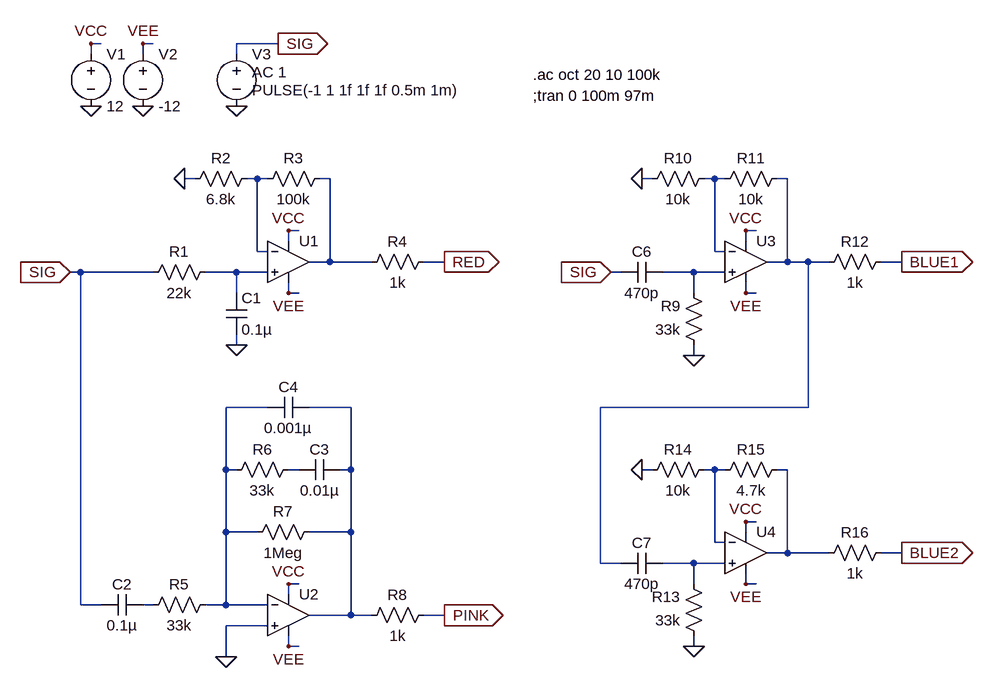
[diagram p0: schematic NOS02_Filter.asc]
NOS02_Filter.asc, the LTspice schematic file:
Version 4
SHEET 1 1352 1156
WIRE -16 -432 -32 -432
WIRE 64 -432 48 -432
WIRE 256 -432 192 -432
WIRE -32 -416 -32 -432
WIRE 48 -416 48 -432
WIRE 192 -416 192 -432
WIRE 128 -224 112 -224
WIRE 224 -224 208 -224
WIRE 240 -224 224 -224
WIRE 336 -224 320 -224
WIRE 832 -224 816 -224
WIRE 928 -224 912 -224
WIRE 944 -224 928 -224
WIRE 1040 -224 1024 -224
WIRE 288 -144 272 -144
WIRE 992 -144 976 -144
WIRE 272 -128 272 -144
WIRE 976 -128 976 -144
WIRE 224 -112 224 -224
WIRE 240 -112 224 -112
WIRE 928 -112 928 -224
WIRE 944 -112 928 -112
WIRE 336 -96 336 -224
WIRE 336 -96 304 -96
WIRE 400 -96 336 -96
WIRE 512 -96 480 -96
WIRE 1040 -96 1040 -224
WIRE 1040 -96 1008 -96
WIRE 1072 -96 1040 -96
WIRE 1104 -96 1072 -96
WIRE 1216 -96 1184 -96
WIRE -48 -80 -64 -80
WIRE 64 -80 -48 -80
WIRE 192 -80 144 -80
WIRE 240 -80 192 -80
WIRE 784 -80 768 -80
WIRE 896 -80 848 -80
WIRE 944 -80 896 -80
WIRE 192 -48 192 -80
WIRE 272 -48 272 -64
WIRE 288 -48 272 -48
WIRE 896 -48 896 -80
WIRE 976 -48 976 -64
WIRE 992 -48 976 -48
WIRE 192 32 192 16
WIRE 896 48 896 32
WIRE 240 128 176 128
WIRE 368 128 304 128
WIRE 1072 128 1072 -96
WIRE 1072 128 752 128
WIRE 176 224 176 128
WIRE 192 224 176 224
WIRE 288 224 272 224
WIRE 368 224 368 128
WIRE 368 224 352 224
WIRE 832 224 816 224
WIRE 928 224 912 224
WIRE 944 224 928 224
WIRE 1040 224 1024 224
WIRE 992 304 976 304
WIRE 176 320 176 224
WIRE 224 320 176 320
WIRE 368 320 368 224
WIRE 368 320 304 320
WIRE 976 320 976 304
WIRE 928 336 928 224
WIRE 944 336 928 336
WIRE 1040 352 1040 224
WIRE 1040 352 1008 352
WIRE 1104 352 1040 352
WIRE 1216 352 1184 352
WIRE 752 368 752 128
WIRE 784 368 752 368
WIRE 896 368 848 368
WIRE 944 368 896 368
WIRE 288 400 272 400
WIRE 896 400 896 368
WIRE 976 400 976 384
WIRE 992 400 976 400
WIRE 272 416 272 400
WIRE -48 432 -48 -80
WIRE -16 432 -48 432
WIRE 64 432 48 432
WIRE 176 432 176 320
WIRE 176 432 144 432
WIRE 240 432 176 432
WIRE 368 448 368 320
WIRE 368 448 304 448
WIRE 400 448 368 448
WIRE 512 448 480 448
WIRE 240 464 176 464
WIRE 272 496 272 480
WIRE 288 496 272 496
WIRE 896 496 896 480
WIRE 176 512 176 464
FLAG 272 -144 VCC
FLAG 272 -48 VEE
FLAG 112 -224 0
FLAG 192 32 0
FLAG 272 400 VCC
FLAG 272 496 VEE
FLAG 176 512 0
FLAG -64 -80 SIG
IOPIN -64 -80 In
FLAG 512 -96 RED
IOPIN 512 -96 Out
FLAG 512 448 PINK
IOPIN 512 448 Out
FLAG -32 -336 0
FLAG 48 -336 0
FLAG -32 -432 VCC
FLAG 48 -432 VEE
FLAG 256 -432 SIG
IOPIN 256 -432 Out
FLAG 192 -336 0
FLAG 976 -144 VCC
FLAG 976 -48 VEE
FLAG 816 -224 0
FLAG 896 48 0
FLAG 1216 -96 BLUE1
IOPIN 1216 -96 Out
FLAG 768 -80 SIG
IOPIN 768 -80 In
FLAG 976 304 VCC
FLAG 976 400 VEE
FLAG 816 224 0
FLAG 896 496 0
FLAG 1216 352 BLUE2
IOPIN 1216 352 Out
SYMBOL Opamps\\UniversalOpamp2 272 -96 R0
SYMATTR InstName U1
SYMBOL res 160 -96 R90
WINDOW 0 0 56 VBottom 2
WINDOW 3 32 56 VTop 2
SYMATTR InstName R1
SYMATTR Value 22k
SYMBOL cap 176 -48 R0
SYMATTR InstName C1
SYMATTR Value 0.1µ
SYMBOL res 224 -240 R90
WINDOW 0 0 56 VBottom 2
WINDOW 3 32 56 VTop 2
SYMATTR InstName R2
SYMATTR Value 6.8k
SYMBOL res 336 -240 R90
WINDOW 0 0 56 VBottom 2
WINDOW 3 32 56 VTop 2
SYMATTR InstName R3
SYMATTR Value 100k
SYMBOL res 496 -112 R90
WINDOW 0 0 56 VBottom 2
WINDOW 3 32 56 VTop 2
SYMATTR InstName R4
SYMATTR Value 1k
SYMBOL Opamps\\UniversalOpamp2 272 448 R0
SYMATTR InstName U2
SYMBOL res 160 416 R90
WINDOW 0 0 56 VBottom 2
WINDOW 3 32 56 VTop 2
SYMATTR InstName R5
SYMATTR Value 33k
SYMBOL cap 48 416 R90
WINDOW 0 0 32 VBottom 2
WINDOW 3 32 32 VTop 2
SYMATTR InstName C2
SYMATTR Value 0.1µ
SYMBOL res 288 208 R90
WINDOW 0 0 56 VBottom 2
WINDOW 3 32 56 VTop 2
SYMATTR InstName R6
SYMATTR Value 33k
SYMBOL res 320 304 R90
WINDOW 0 0 56 VBottom 2
WINDOW 3 32 56 VTop 2
SYMATTR InstName R7
SYMATTR Value 1Meg
SYMBOL res 496 432 R90
WINDOW 0 0 56 VBottom 2
WINDOW 3 32 56 VTop 2
SYMATTR InstName R8
SYMATTR Value 1k
SYMBOL cap 352 208 R90
WINDOW 0 0 32 VBottom 2
WINDOW 3 32 32 VTop 2
SYMATTR InstName C3
SYMATTR Value 0.01µ
SYMBOL cap 304 112 R90
WINDOW 0 0 32 VBottom 2
WINDOW 3 32 32 VTop 2
SYMATTR InstName C4
SYMATTR Value 0.001µ
SYMBOL voltage -32 -432 R0
WINDOW 123 0 0 Left 0
WINDOW 39 0 0 Left 0
SYMATTR InstName V1
SYMATTR Value 12
SYMBOL voltage 48 -432 R0
WINDOW 123 0 0 Left 0
WINDOW 39 0 0 Left 0
SYMATTR InstName V2
SYMATTR Value -12
SYMBOL voltage 192 -432 R0
WINDOW 123 24 44 Left 2
WINDOW 39 0 0 Left 0
WINDOW 3 24 72 Left 2
SYMATTR Value2 AC 1
SYMATTR Value PULSE(-1 1 1f 1f 1f 0.5m 1m)
SYMATTR InstName V3
SYMBOL Opamps\\UniversalOpamp2 976 -96 R0
SYMATTR InstName U3
SYMBOL res 912 48 R180
WINDOW 0 36 76 Left 2
WINDOW 3 36 40 Left 2
SYMATTR InstName R9
SYMATTR Value 33k
SYMBOL cap 848 -96 R90
WINDOW 0 0 32 VBottom 2
WINDOW 3 32 32 VTop 2
SYMATTR InstName C6
SYMATTR Value 470p
SYMBOL res 928 -240 R90
WINDOW 0 0 56 VBottom 2
WINDOW 3 32 56 VTop 2
SYMATTR InstName R10
SYMATTR Value 10k
SYMBOL res 1040 -240 R90
WINDOW 0 0 56 VBottom 2
WINDOW 3 32 56 VTop 2
SYMATTR InstName R11
SYMATTR Value 10k
SYMBOL res 1200 -112 R90
WINDOW 0 0 56 VBottom 2
WINDOW 3 32 56 VTop 2
SYMATTR InstName R12
SYMATTR Value 1k
SYMBOL Opamps\\UniversalOpamp2 976 352 R0
SYMATTR InstName U4
SYMBOL res 912 496 R180
WINDOW 0 36 76 Left 2
WINDOW 3 36 40 Left 2
SYMATTR InstName R13
SYMATTR Value 33k
SYMBOL cap 848 352 R90
WINDOW 0 0 32 VBottom 2
WINDOW 3 32 32 VTop 2
SYMATTR InstName C7
SYMATTR Value 470p
SYMBOL res 928 208 R90
WINDOW 0 0 56 VBottom 2
WINDOW 3 32 56 VTop 2
SYMATTR InstName R14
SYMATTR Value 10k
SYMBOL res 1040 208 R90
WINDOW 0 0 56 VBottom 2
WINDOW 3 32 56 VTop 2
SYMATTR InstName R15
SYMATTR Value 4.7k
SYMBOL res 1200 336 R90
WINDOW 0 0 56 VBottom 2
WINDOW 3 32 56 VTop 2
SYMATTR InstName R16
SYMATTR Value 1k
TEXT 648 -384 Left 2 !.ac oct 20 10 100k
TEXT 648 -352 Left 2 !;tran 0 100m 97m

The netlist it stands for:
* NOS02_Filter.asc
XU1 N005 N001 VCC VEE N002 level.2 Avol=1Meg GBW=10Meg Slew=10Meg ilimit=25m rail=0 Vos=0 phimargin=45 en=0 enk=0 in=0 ink=0 Rin=500Meg  ; pins IN+ IN- V+ V- OUT
R1 N005 SIG 22k
C1 N005 0 0.1µ
R2 N001 0 6.8k
R3 N002 N001 100k
R4 RED N002 1k
XU2 0 N007 VCC VEE N008 level.2 Avol=1Meg GBW=10Meg Slew=10Meg ilimit=25m rail=0 Vos=0 phimargin=45 en=0 enk=0 in=0 ink=0 Rin=500Meg  ; pins IN+ IN- V+ V- OUT
R5 N007 N013 33k
C2 N013 SIG 0.1µ
R6 N009 N007 33k
R7 N008 N007 1Meg
R8 PINK N008 1k
C3 N008 N009 0.01µ
C4 N008 N007 0.001µ
V1 VCC 0 12
V2 VEE 0 -12
V3 SIG 0 PULSE(-1 1 1f 1f 1f 0.5m 1m) AC 1
XU3 N006 N003 VCC VEE N004 level.2 Avol=1Meg GBW=10Meg Slew=10Meg ilimit=25m rail=0 Vos=0 phimargin=45 en=0 enk=0 in=0 ink=0 Rin=500Meg  ; pins IN+ IN- V+ V- OUT
R9 0 N006 33k
C6 N006 SIG 470p
R10 N003 0 10k
R11 N004 N003 10k
R12 BLUE1 N004 1k
XU4 N012 N010 VCC VEE N011 level.2 Avol=1Meg GBW=10Meg Slew=10Meg ilimit=25m rail=0 Vos=0 phimargin=45 en=0 enk=0 in=0 ink=0 Rin=500Meg  ; pins IN+ IN- V+ V- OUT
R13 0 N012 33k
C7 N012 N004 470p
R14 N010 0 10k
R15 N011 N010 4.7k
R16 BLUE2 N011 1k
.ac oct 20 10 100k
;tran 0 100m 97m
.lib UniversalOpamps2.sub
.backanno
.end